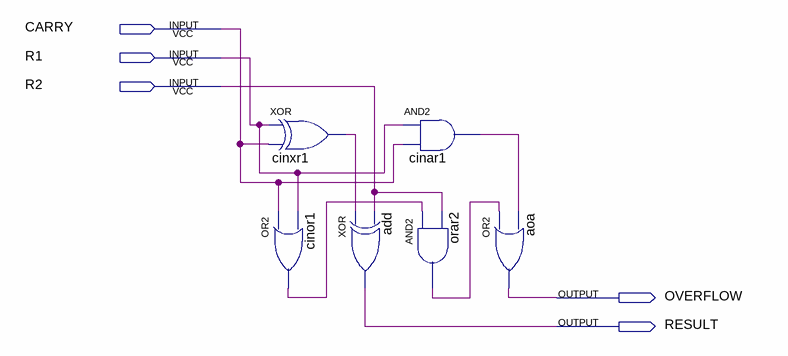
[diagram p0: schematic sheet]
// Quartus schematic Add.bdf as structural Verilog: 6 symbols, 5 pins
module Add (
  input  CARRY,
  input  R1,
  input  R2,
  output OVERFLOW,
  output RESULT
);

  wire cinar1_out, cinor1_out, cinxr1_out, orar2_out;

  xor cinxr1 (cinxr1_out, R1, CARRY);
  or cinor1 (cinor1_out, CARRY, R1);
  xor add (RESULT, cinxr1_out, R2);
  and cinar1 (cinar1_out, R1, CARRY);
  and orar2 (orar2_out, cinor1_out, R2);
  or aoa (OVERFLOW, orar2_out, cinar1_out);
endmodule
